# Altium schematic sheet Fonte_Chaveada_ISL6236.SchDoc
size A3
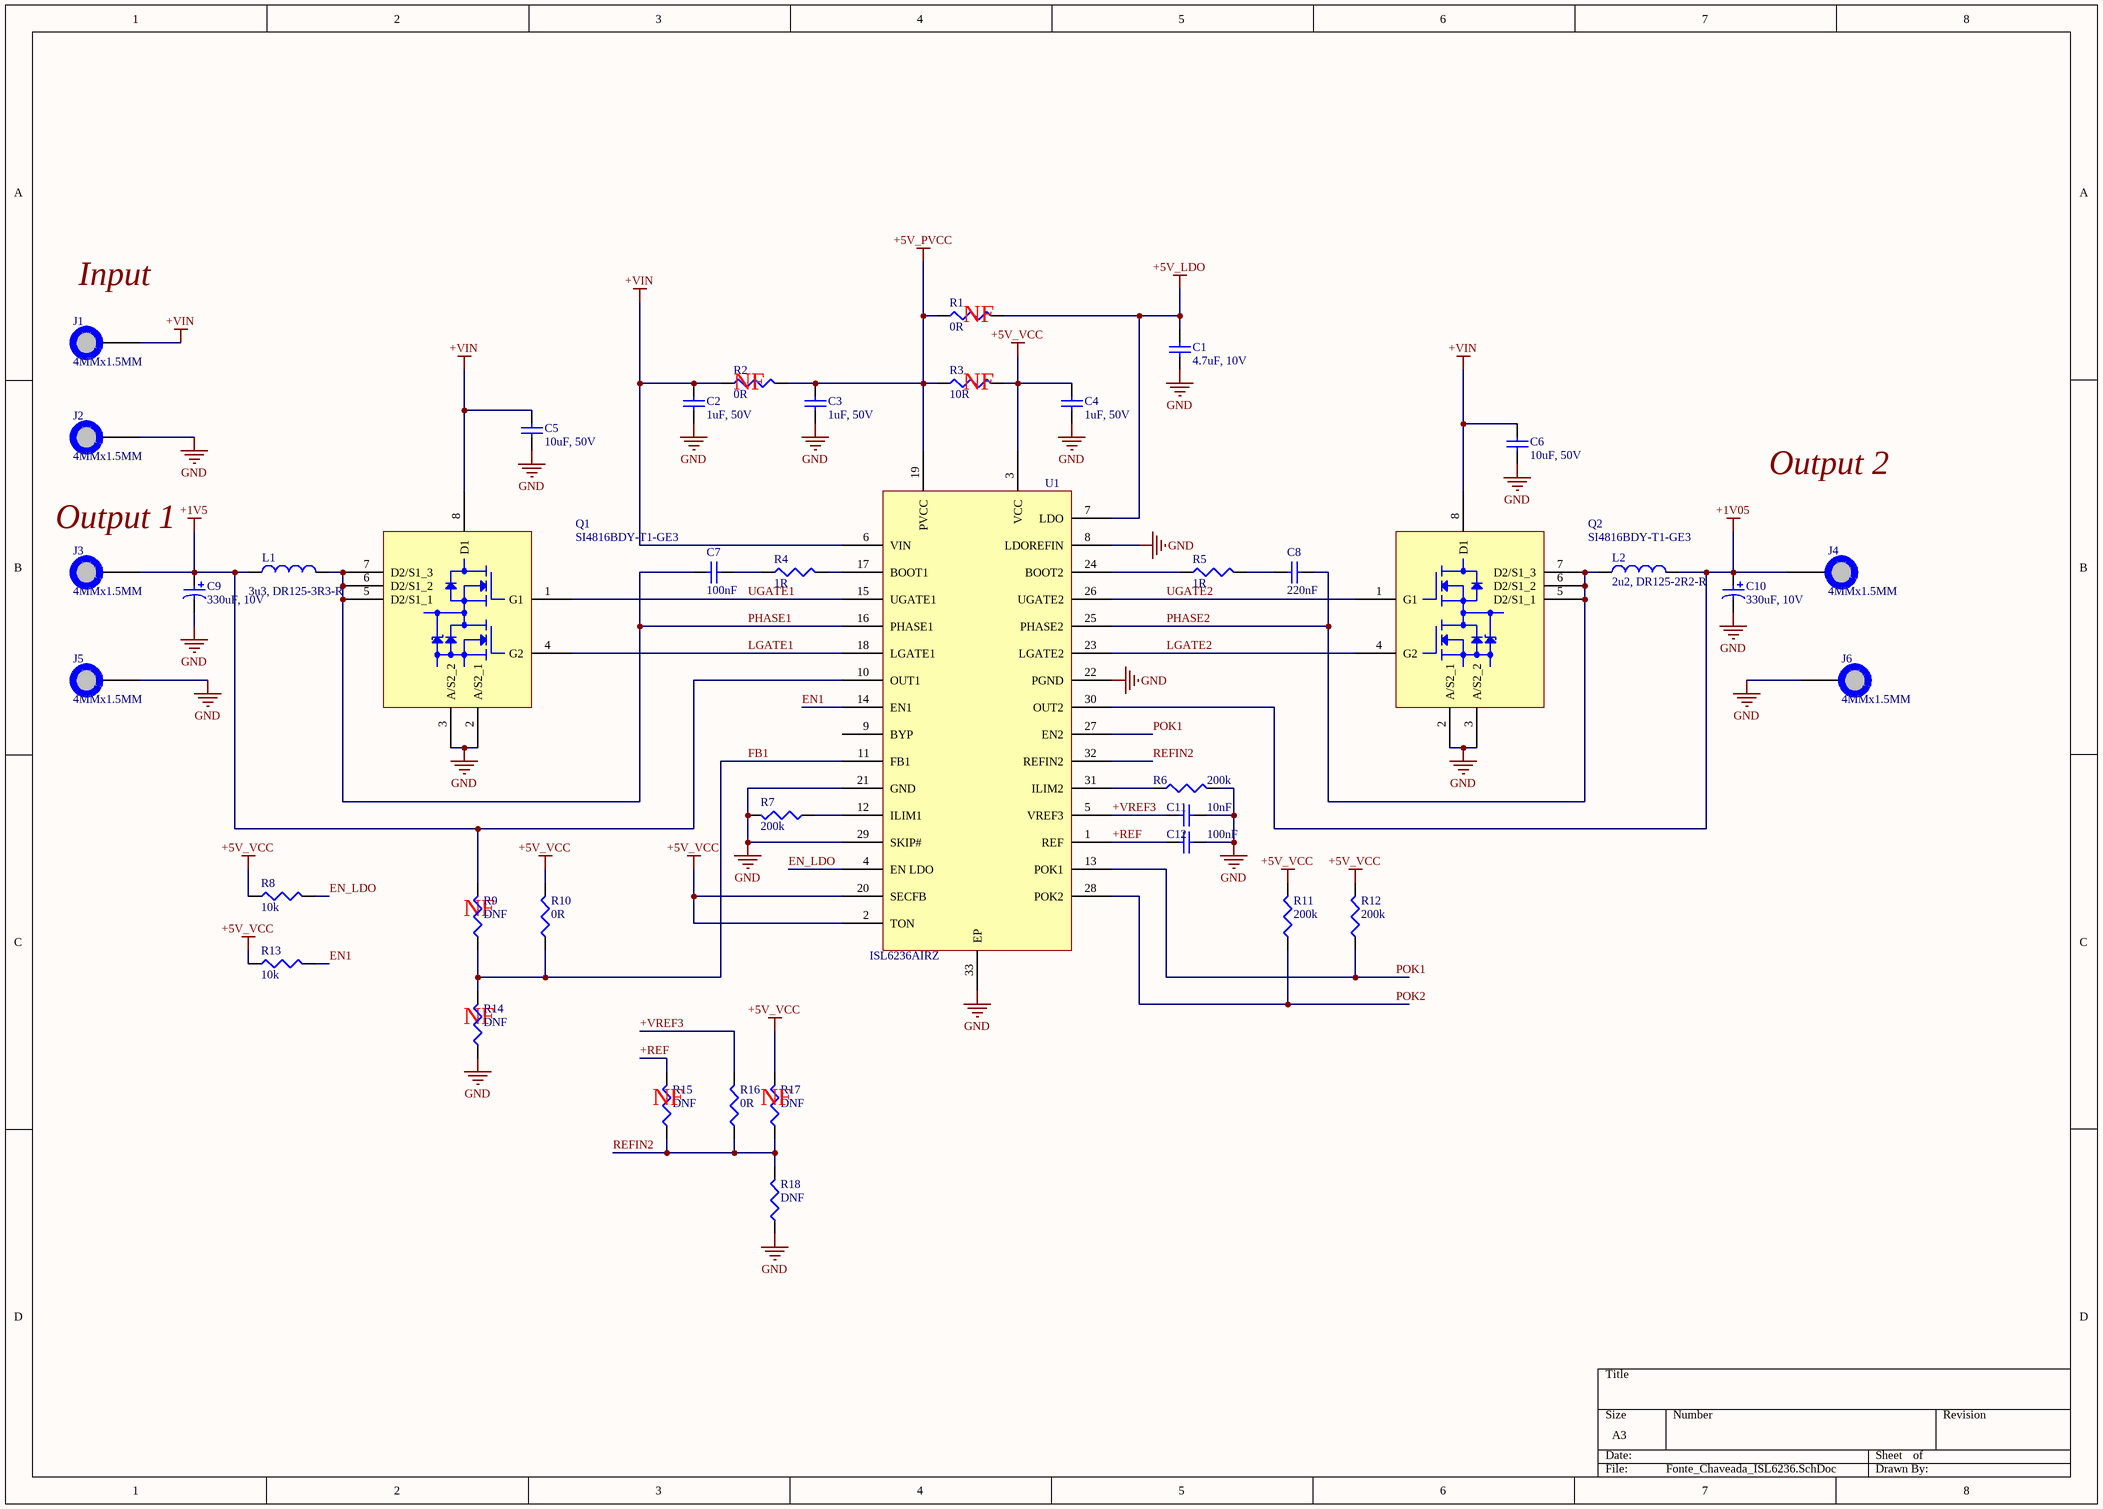
[diagram p0: Fonte_Chaveada_ISL6236.SchDoc]

## Parts
C1  4.7uF, 10V  [C1206]
C2  1uF, 50V  [C0805]
C3  1uF, 50V  [C0805]
C4  1uF, 50V  [C0805]
C5  10uF, 50V  [C1210]
C6  10uF, 50V  [C1210]
C7  100nF  [C0805]
C8  220nF  [C0805]
C9  330uF, 10V  [7343-43]
C10  330uF, 10V  [7343-43]
C11  10nF  [C0805]
C12  100nF  [C0805]
J1  4MMx1.5MM  [PAD]
J2  4MMx1.5MM  [PAD]
J3  4MMx1.5MM  [PAD]
J4  4MMx1.5MM  [PAD]
J5  4MMx1.5MM  [PAD]
J6  4MMx1.5MM  [PAD]
L1  3u3, DR125-3R3-R  [DR125]
L2  2u2, DR125-2R2-R  [DR125]
Q1  SI4816BDY-T1-GE3  [SO-8]
Q2  SI4816BDY-T1-GE3  [SO-8]
R1  0R  [R0805]
R2  0R  [R0805]
R3  10R  [R0805]
R4  1R  [R0805]
R5  1R  [R0805]
R6  200k  [R0805]
R7  200k  [R0805]
R8  10k  [R0805]
R9  DNF  [R0805]
R10  0R  [R0805]
R11  200k  [R0805]
R12  200k  [R0805]
R13  10k  [R0805]
R14  DNF  [R0805]
R15  DNF  [R0805]
R16  0R  [R0805]
R17  DNF  [R0805]
R18  DNF  [R0805]
U1  ISL6236AIRZ  [L32.5x5B]

## Nets
+1V5: C9.1 J3.1 L1.1 R9.2 U1.10(OUT1)
+1V05: C10.1 J4.1 L2.2 U1.30(OUT2)
+5V_LDO: C1.2 R1.2 U1.7(LDO)
+5V_PVCC: C3.2 R1.1 R2.2 R3.1 U1.19(PVCC)
+5V_VCC: C4.2 R3.2 R8.1 R10.2 R11.2 R12.2 R13.1 R17.2 U1.2(TON) U1.3(VCC) U1.20(SECFB)
+VIN: C2.2 C5.2 C6.2 J1.1 Q1.8(D1) Q2.8(D1) R2.1 U1.6(VIN)
GND: C1.1 C2.1 C3.1 C4.1 C5.1 C6.1 C9.2 C10.2 C11.2 C12.2 J2.1 J5.1 J6.1 Q1.2(A/S2_1) Q1.3(A/S2_2) Q2.2(A/S2_1) Q2.3(A/S2_2) R6.2 R7.2 R14.1 R18.1 U1.8(LDOREFIN) U1.21(GND) U1.22(PGND) U1.29(SKIP#) U1.33(EP)
+REF: C12.1 R15.2 U1.1(REF)
+VREF3: C11.1 R16.2 U1.5(VREF3)
EN1: R13.2 U1.14(EN1)
EN_LDO: R8.2 U1.4(EN_LDO)
FB1: R9.1 R10.1 R14.2 U1.11(FB1)
LGATE1: Q1.4(G2) U1.18(LGATE1)
LGATE2: Q2.4(G2) U1.23(LGATE2)
PHASE1: C7.1 L1.2 Q1.5(D2/S1_1) Q1.6(D2/S1_2) Q1.7(D2/S1_3) U1.16(PHASE1)
PHASE2: C8.2 L2.1 Q2.5(D2/S1_1) Q2.6(D2/S1_2) Q2.7(D2/S1_3) U1.25(PHASE2)
POK1: R12.1 U1.13(POK1) U1.27(EN2)
POK2: R11.1 U1.28(POK2)
REFIN2: R15.1 R16.1 R17.1 R18.2 U1.32(REFIN2)
UGATE1: Q1.1(G1) U1.15(UGATE1)
UGATE2: Q2.1(G1) U1.26(UGATE2)
NetC7_2: C7.2 R4.1
NetC8_1: C8.1 R5.2
NetR4_2: R4.2 U1.17(BOOT1)
NetR5_1: R5.1 U1.24(BOOT2)
NetR6_1: R6.1 U1.31(ILIM2)
NetR7_1: R7.1 U1.12(ILIM1)

Not connected (* = marked no-connect by the designer): U1 9(BYP)

## Notes on the sheet
- (near J1) Input
- (near R1) NF
- (near R2) NF
- (near R3) NF
- Output 2
- Output 1
- (near R9) NF
- (near R14) NF
- (near R15) NF
- (near R17) NF

## Library data of the parts
C1 = C3216X5R1A475K: 4.7µF ±10% 10V X5R Ceramic Capacitor -55°C ~ 85°C Surface Mount, MLCC 1206 (3216 Metric) 0.126" L x 0.063" W (3.20mm x 1.60mm); Manufacturer: TDK; Supplier 1: Digi-Key; Manufacturer Part Number: C3216X5R1A475K; Stock 1: 0; Mount: Surface Mount; Case/Package: 1206; Number of Pins: 2; Case Code (Metric): 3216; Case Code (Imperial): 1206; Dielectric Material: Ceramic; Min Operating Temperature: -55°C; Max Operating Temperature: 85°C; Capacitance: 4.7uF; Tolerance: 10%; Package Quantity: 2000; Voltage Rating: 10V; Packaging: Tape and Reel; Dielectric: X5R; Termination: SMD/SMT; Voltage Rating (DC): 10V; Length: 3.2mm; Width: 0.063inch; Thickness: 0.071inch; Depth: 1.6mm; Radiation Hardening: No; Lead Free: Lead Free; ComponentLink1URL: https://media.digikey.com/pdf/Data%20Sheets/TDK%20PDFs/C_Series_GeneralAppl_Spec_rev_0.3_201012.pdf; ComponentLink1Description: https://media.digikey.com/pdf/Data%20Sheets/TDK%20PDFs/C_Series_GeneralAppl_Spec_rev_0.3_201012.pdf; ComponentLink2URL: https://www.verical.com/server-webapp/html/getDatasheet?partID=178730; ComponentLink2Description: https://www.verical.com/server-webapp/html/getDatasheet?partID=178730; ComponentLink3URL: http://www.tdk.co.jp/tefe02/e412_c.pdf; ComponentLink3Description: http://www.tdk.co.jp/tefe02/e412_c.pdf; ComponentLink4URL: http://www.mouser.com/ds/2/400/tdk_mlcc_commercial_general_en-542463.pdf; ComponentLink4Description: http://www.mouser.com/ds/2/400/tdk_mlcc_commercial_general_en-542463.pdf; ComponentLink5URL: http://www.farnell.com/datasheets/1571323.pdf; ComponentLink5Description: http://www.farnell.com/datasheets/1571323.pdf; ComponentLink6URL: http://www.onlinecomponents.com/productFiles/mf-TDK/e412_c.pdf; ComponentLink6Description: http://www.onlinecomponents.com/productFiles/mf-TDK/e412_c.pdf; Supplier Part Number 1: 445-1386-6-ND
C2-C4 = C2012X7R1H105K125AB: CAP CER 1UF 50V X7R 0805; Manufacturer: TDK; Dielectric Material: Ceramic; Tolerance: 10%; Supplier 1: Digi-Key; Manufacturer Part Number: C2012X7R1H105K125AB; Stock 1: 20000; Pricing 1: 1=0.42, 10=0.286, 100=0.1619, 500=0.1143, 1000=0.1 (USD); Mount: Surface Mount; Case/Package: 0805; Number of Pins: 2; Weight: 0.000194oz; Case Code (Metric): 2012; Case Code (Imperial): 0805; Min Operating Temperature: -55°C; Max Operating Temperature: 125°C; Packaging: Tape and Reel; Package Quantity: 1; Capacitance: 1uF; Voltage Rating: 50V; Voltage Rating (DC): 50V; Dielectric: X7R; Termination: SMD/SMT; Composition: Ceramic; Length: 2mm; Height: 1.25mm; Width: 0.049inch; Thickness: 0.057inch; Depth: 1.25mm; Radiation Hardening: No; REACH SVHC: No SVHC; Lead Free: Lead Free; ComponentLink1URL: http://www.farnell.com/datasheets/1796654.pdf; ComponentLink1Description: http://www.farnell.com/datasheets/1796654.pdf; ComponentLink2URL: https://product.tdk.com/info/en/catalog/spec/mlccspec_commercial_general_midvoltage_en.pdf; ComponentLink2Description: https://product.tdk.com/info/en/catalog/spec/mlccspec_commercial_general_midvoltage_en.pdf; ComponentLink3URL: http://www.tdk.com/pdf/general_B11.pdf; ComponentLink3Description: http://www.tdk.com/pdf/general_B11.pdf; ComponentLink4URL: http://www.mouser.com/ds/2/400/lcc_commercial_general_en-837201.pdf; ComponentLink4Description: http://www.mouser.com/ds/2/400/lcc_commercial_general_en-837201.pdf; ComponentLink5URL: http://www.farnell.com/datasheets/2291921.pdf; ComponentLink5Description: http://www.farnell.com/datasheets/2291921.pdf; ComponentLink6URL: http://product.tdk.com/capacitor/mlcc/en/documents/mlcc_commercial_general_en.pdf; ComponentLink6Description: http://product.tdk.com/capacitor/mlcc/en/documents/mlcc_commercial_general_en.pdf; Supplier Part Number 1: 445-7547-6-ND
C5 C6 = UMK325BJ106MM-T: CAP CER 10UF 50V X5R 1210; Manufacturer: Taiyo Yuden; Tolerance: 20%; Supplier 1: Digi-Key; Manufacturer Part Number: UMK325BJ106MM-T; Stock 1: 0; Pricing 1: 1=0.78, 10=0.554, 100=0.3645 (USD); Mount: Surface Mount; Case/Package: 1210; Number of Pins: 2; Case Code (Metric): 3225; Case Code (Imperial): 1210; Contact Plating: Nickel; Min Operating Temperature: -55°C; Max Operating Temperature: 85°C; Capacitance: 10uF; Package Quantity: 500; Voltage Rating: 50V; Packaging: Tape and Reel; Voltage Rating (DC): 50V; Dielectric: X5R; Termination: SMD/SMT; Voltage: 50V; Length: 3.2mm; Height: 2.5mm; Width: 0.098inch; Thickness: 0.106inch; Depth: 2.5mm; Radiation Hardening: No; REACH SVHC: Unknown; Lead Free: Lead Free; Halogen Free: Halogen Free; ComponentLink1URL: https://www.yuden.co.jp/productdata/catalog/mlcc01_e.pdf; ComponentLink1Description: https://www.yuden.co.jp/productdata/catalog/mlcc01_e.pdf; ComponentLink2URL: http://www.farnell.com/datasheets/1497285.pdf; ComponentLink2Description: http://www.farnell.com/datasheets/1497285.pdf; ComponentLink3URL: http://www.onlinecomponents.com/productFiles/mf-TAI/1153umk325bj106mm-t.pdf; ComponentLink3Description: http://www.onlinecomponents.com/productFiles/mf-TAI/1153umk325bj106mm-t.pdf; ComponentLink4URL: http://www.yuden.co.jp/ut/product/pdf_html/pdf/mlcc_all_e.pdf; ComponentLink4Description: http://www.yuden.co.jp/ut/product/pdf_html/pdf/mlcc_all_e.pdf; ComponentLink5URL: http://www.yuden.co.jp/ut/product/category/capacitor/UMK325BJ106MM-T.pdf; ComponentLink5Description: http://www.yuden.co.jp/ut/product/category/capacitor/UMK325BJ106MM-T.pdf; ComponentLink6URL: http://www.farnell.com/datasheets/1481447.pdf; ComponentLink6Description: http://www.farnell.com/datasheets/1481447.pdf; Supplier Part Number 1: 587-2225-6-ND
C7 C12 = C2012X7R1H104K085AA: CAP CER 0.1UF 50V X7R 0805; Manufacturer: TDK; Dielectric Material: Ceramic; Tolerance: 10%; Supplier 1: Digi-Key; Manufacturer Part Number: C2012X7R1H104K085AA; Stock 1: 0; Pricing 1: 4000=0.0274 (USD); Mount: Surface Mount; Case/Package: 0805; Number of Pins: 2; Weight: 0.000194oz; Case Code (Metric): 2012; Case Code (Imperial): 0805; Min Operating Temperature: -55°C; Max Operating Temperature: 125°C; Package Quantity: 1; Packaging: Tape and Reel; Capacitance: 100nF; Voltage Rating: 50V; Voltage Rating (DC): 50V; Dielectric: X7R; Termination: SMD/SMT; Composition: Ceramic; Voltage: 50V; Length: 2mm; Height: 0.85mm; Width: 0.049inch; Thickness: 0.037inch; Depth: 1.25mm; Radiation Hardening: No; REACH SVHC: No SVHC; Lead Free: Lead Free; ComponentLink1URL: http://uk.rs-online.com/webdocs/1532/0900766b81532cd0.pdf; ComponentLink1Description: http://uk.rs-online.com/webdocs/1532/0900766b81532cd0.pdf; ComponentLink2URL: https://product.tdk.com/info/en/catalog/spec/mlccspec_commercial_general_midvoltage_en.pdf; ComponentLink2Description: https://product.tdk.com/info/en/catalog/spec/mlccspec_commercial_general_midvoltage_en.pdf; ComponentLink3URL: http://www.tdk.co.jp/tefe02/e412_c.pdf; ComponentLink3Description: http://www.tdk.co.jp/tefe02/e412_c.pdf; ComponentLink4URL: http://www.farnell.com/datasheets/1571323.pdf; ComponentLink4Description: http://www.farnell.com/datasheets/1571323.pdf; Supplier Part Number 1: 445-7534-2-ND
C8 = C2012X7R1H224K125AA: CAP CER 0.22UF 50V X7R 0805; Manufacturer: TDK; Dielectric Material: Ceramic; Tolerance: 10%; Supplier 1: Digi-Key; Manufacturer Part Number: C2012X7R1H224K125AA; Stock 1: 0; Pricing 1: 1=0.21, 10=0.152, 100=0.0713, 500=0.05, 1000=0.0414 (USD); Mount: Surface Mount; Case/Package: 0805; Number of Pins: 2; Weight: 0.000194oz; Case Code (Metric): 2012; Case Code (Imperial): 0805; Min Operating Temperature: -55°C; Max Operating Temperature: 125°C; Capacitance: 220nF; Voltage Rating: 50V; Packaging: Tape and Reel; Package Quantity: 1; Voltage Rating (DC): 50V; Dielectric: X7R; Termination: SMD/SMT; Composition: Ceramic; Voltage: 50V; Length: 2mm; Height: 1.25mm; Width: 0.049inch; Thickness: 0.057inch; Depth: 1.25mm; Radiation Hardening: No; REACH SVHC: No SVHC; Lead Free: Lead Free; ComponentLink1URL: http://www.tdk.co.jp/tefe02/e412_c.pdf; ComponentLink1Description: http://www.tdk.co.jp/tefe02/e412_c.pdf; ComponentLink2URL: https://product.tdk.com/info/en/catalog/spec/mlccspec_commercial_general_midvoltage_en.pdf; ComponentLink2Description: https://product.tdk.com/info/en/catalog/spec/mlccspec_commercial_general_midvoltage_en.pdf; ComponentLink3URL: http://www.farnell.com/datasheets/1571323.pdf; ComponentLink3Description: http://www.farnell.com/datasheets/1571323.pdf; ComponentLink4URL: http://uk.rs-online.com/webdocs/1532/0900766b81532cd0.pdf; ComponentLink4Description: http://uk.rs-online.com/webdocs/1532/0900766b81532cd0.pdf; ComponentLink5URL: http://www.mouser.com/ds/2/400/lcc_commercial_general_en-837201.pdf; ComponentLink5Description: http://www.mouser.com/ds/2/400/lcc_commercial_general_en-837201.pdf; Supplier Part Number 1: 445-1350-6-ND
C9 C10 = T530X337M010ATE004: Tantalum Capacitors - Polymer SMD 330uF 10volts 20%; Manufacturer: KEMET; Ripple Current: 8.2A; ESR (Equivalent Series Resistance): 4mR; Leakage Current: 330uA; Polarity: Polar; Dissipation Factor: 8%; Life (Hours): 2000Hour; Supplier 1: Digi-Key; Manufacturer Part Number: T530X337M010ATE004; Stock 1: 0; Pricing 1: 1=6.86, 10=6.095, 100=4.876 (USD); Mount: PCB,Surface Mount; Case/Package: 2917; Case Code (Imperial): 2917; Case Code (Metric): 7343; Min Operating Temperature: -55°C; Max Operating Temperature: 125°C; Package Quantity: 500; Voltage Rating (DC): 10V; Capacitance: 330uF; Tolerance: 20%; Packaging: Tape and Reel; Voltage Rating: 10V; Termination: SMD/SMT; Voltage: 10V; Features: General Purpose; Length: 7.3mm; Height: 4mm; Width: 4.3mm; Height - Seated (Max): 0.169inch; Depth: 4.3mm; REACH SVHC: No SVHC; ComponentLink1URL: https://www.alliedelec.com/m/d/c2b5846d1b4015924ec44504ba06510b.pdf; ComponentLink1Description: https://www.alliedelec.com/m/d/c2b5846d1b4015924ec44504ba06510b.pdf; ComponentLink2URL: http://uk.rs-online.com/webdocs/1529/0900766b815291cb.pdf; ComponentLink2Description: http://uk.rs-online.com/webdocs/1529/0900766b815291cb.pdf; Supplier Part Number 1: 399-10378-6-ND
C11 = VJ0805Y103KNAAO: CAP CER 10000PF 50V X7R 0805; Manufacturer: Vishay Vitramon; Tolerance: 10%; Supplier 1: Digi-Key; Manufacturer Part Number: VJ0805Y103KNAAO; Stock 1: 211; Pricing 1: 1=0.88, 10=0.65, 100=0.4457 (USD); Mount: Surface Mount; Case/Package: 0805; Case Code (Metric): 2012; Case Code (Imperial): 0805; Min Operating Temperature: -55°C; Max Operating Temperature: 125°C; Packaging: Tape and Reel; Capacitance: 10nF; Package Quantity: 1; Voltage Rating: 50V; Voltage Rating (DC): 50V; Dielectric: X7R; Termination: SMD/SMT; Voltage: 50V; Length: 2mm; Height: 1.45mm; Width: 0.049inch; Thickness: 0.057inch; Depth: 1.25mm; Radiation Hardening: No; REACH SVHC: Unknown; ComponentLink1URL: http://www.vishay.com/docs/45128/nonmagneticepoxybond.pdf; ComponentLink1Description: http://www.vishay.com/docs/45128/nonmagneticepoxybond.pdf; ComponentLink2URL: http://www.farnell.com/datasheets/1805046.pdf; ComponentLink2Description: http://www.farnell.com/datasheets/1805046.pdf; Supplier Part Number 1: 720-1244-1-ND
J1-J6 = PAD com furo
L1 = DR125-3R3-R: COILTRONICS   DR125-3R3-R   Surface Mount Power Inductor, DR Series, 3.3 H,  20%, Shielded, 9.26 A; Manufacturer: Eaton Coiltronics; Core Material: Ferrite; Inductance: 3.3uh; Max DC Current: 12.7A; DC Resistance (DCR): 6.3mR; Test Frequency: 100kHz; RMS Current (Irms): 9.26A; Supplier 1: Digi-Key; Manufacturer Part Number: DR125-3R3-R; Stock 1: 4659; Pricing 1: 1=2.03, 10=1.873, 100=1.3113 (USD); Mount: Surface Mount; Case/Package: 0125; Number of Pins: 2; Weight: 0.144oz; Min Operating Temperature: -40°C; Max Operating Temperature: 125°C; Tolerance: 20%; Packaging: Tape and Reel; Shielding: Shielded; Inductance Tolerance: 20%; Package Quantity: 600; Termination: SMD/SMT; Military Standard: Not; Saturation Current: 12.7A; Self Resonant Frequency: 100kHz; Length: 12.5mm; Height: 6mm; Width: 12.5mm; Depth: 12.5mm; Radiation Hardening: No; REACH SVHC: No SVHC; Lead Free: Lead Free; ComponentLink1URL: http://www.farnell.com/datasheets/87246.pdf; ComponentLink1Description: http://www.farnell.com/datasheets/87246.pdf; Supplier Part Number 1: 513-1529-6-ND
L2 = DR125-2R2-R: Fixed Inductors 2.2uH 15A 0.0045ohms; Manufacturer: Eaton Cooper; Core Material: Ferrite; Current Rating: 10.9A; Tolerance: 20%; Shielding: Shielded; DC Resistance (DCR): 4.5mR; Test Frequency: 100kHz; Supplier 1: Digi-Key; Manufacturer Part Number: DR125-2R2-R; Stock 1: 175; Pricing 1: 1=2.03, 10=1.873, 100=1.3113 (USD); Mount: Surface Mount; Case/Package: Nonstandard; Number of Pins: 2; Weight: 0.144oz; Min Operating Temperature: -40°C; Max Operating Temperature: 125°C; Package Quantity: 600; Saturation Current: 15A; Packaging: Tape and Reel; Inductance: 2.2uh; Inductance Tolerance: 20%; Composition: Wirewound; Max DC Current: 10.9A; Termination: SMD/SMT; Self Resonant Frequency: 100kHz; DC Current: 10.9A; Military Standard: Not; RMS Current (Irms): 10.9A; Length: 12.5mm; Height: 6mm; Width: 0.492inch; Height - Seated (Max): 0.236inch; Depth: 12.5mm; Radiation Hardening: No; REACH SVHC: No SVHC; Lead Free: Lead Free; ComponentLink1URL: https://www.verical.com/server-webapp/html/getDatasheet?partID=571249; ComponentLink1Description: https://www.verical.com/server-webapp/html/getDatasheet?partID=571249; ComponentLink2URL: http://uk.rs-online.com/webdocs/116a/0900766b8116a153.pdf; ComponentLink2Description: http://uk.rs-online.com/webdocs/116a/0900766b8116a153.pdf; ComponentLink3URL: http://www.farnell.com/datasheets/87246.pdf; ComponentLink3Description: http://www.farnell.com/datasheets/87246.pdf; Supplier Part Number 1: 513-1662-6-ND
Q1 Q2 = SI4816BDY-T1-GE3: MOSFET 2N-CH 30V 5.8A 8-SOIC; Manufacturer: Vishay Siliconix; Rise Time: 9ns; Rds On Max: 18.5mR; Gate to Source Voltage (Vgs): 20V; Drain to Source Resistance: 9.3mR; Max Power Dissipation: 1.25W; Turn-Off Delay Time: 31ns; Turn-On Delay Time: 13ns; Number of Elements: 2; Threshold Voltage: 3V; FET Type: 2 N-Channel; Supplier 1: Digi-Key; Manufacturer Part Number: SI4816BDY-T1-GE3; Stock 1: 0; Pricing 1: 1=1.86, 10=1.681, 100=1.3511, 500=1.0509, 1000=0.8707 (USD); Mount: Surface Mount; Case/Package: SO; Number of Pins: 8; Weight: 0.006596oz; Contact Plating: Matte,Tin; Min Operating Temperature: -55°C; Max Operating Temperature: 150°C; Packaging: Tape and Reel; Package Quantity: 1; Drain to Source Voltage (Vdss): 30V; Continuous Drain Current (ID): 5.8A; Fall Time: 9ns; Number of Channels: 2; On-State Resistance: 18.5mR; Length: 5mm; Height: 1.55mm; Width: 4mm; Radiation Hardening: No; REACH SVHC: No SVHC; Lead Free: Lead Free; ComponentLink1URL: http://www.farnell.com/datasheets/1911984.pdf; ComponentLink1Description: http://www.farnell.com/datasheets/1911984.pdf; ComponentLink2URL: http://www.farnell.com/datasheets/2049212.pdf; ComponentLink2Description: http://www.farnell.com/datasheets/2049212.pdf; ComponentLink3URL: http://www.vishay.com/docs/73026/si4816bd.pdf; ComponentLink3Description: http://www.vishay.com/docs/73026/si4816bd.pdf; ComponentLink4URL: http://datasheet.iiic.cc/vishay_[siliconix]/SI4816BDY-T1-GE3.pdf; ComponentLink4Description: http://datasheet.iiic.cc/vishay_[siliconix]/SI4816BDY-T1-GE3.pdf; Supplier Part Number 1: SI4816BDY-T1-GE3DKR-ND
R1 R2 R10 R16 = ERJ6GEY0R00V: Res Thick Film 0805 0 Ohm Molded SMD SMD Embossed Carrier T/R; Manufacturer: Panasonic; Voltage Rating: 150V; Resistance: 0mR; Power Rating: 125mW; Tolerance: 5%; Temperature Coefficient: 600ppm/°C; Current Rating: 2A; Supplier 1: Digi-Key; Manufacturer Part Number: ERJ6GEY0R00V; Stock 1: 6984745; Pricing 1: 1=0.1, 10=0.06, 25=0.0432, 50=0.033, 100=0.0243, 250=0.0185, 500=0.0148, 1000=0.0109 (USD); Mount: Surface Mount; Case/Package: 0805; Case Code (Imperial): 0805; Case Code (Metric): 2012; Contact Plating: Tin; Min Operating Temperature: -55°C; Max Operating Temperature: 155°C; Packaging: Tape and Reel; Package Quantity: 1; Termination: SMD/SMT; Composition: Thick Film; Number of Terminations: 2; Military Standard: Not; Max Power Dissipation: 125mW; Voltage Rating (DC): 150V; Features: Automotive AEC-Q200; Length: 2mm; Height: 0.6mm; Width: 1.25mm; Depth: 1.25mm; Radiation Hardening: No; REACH SVHC: No SVHC; Lead Free: Lead Free; ComponentLink1URL: http://www.farnell.com/datasheets/1678796.pdf; ComponentLink1Description: http://www.farnell.com/datasheets/1678796.pdf; ComponentLink2URL: http://www.farnell.com/datasheets/2371628.pdf; ComponentLink2Description: http://www.farnell.com/datasheets/2371628.pdf; ComponentLink3URL: http://industrial.panasonic.com/www-data/pdf/AOA0000/AOA0000CE1.pdf; ComponentLink3Description: http://industrial.panasonic.com/www-data/pdf/AOA0000/AOA0000CE1.pdf; ComponentLink4URL: http://industrial.panasonic.com/www-cgi/jvcr13pz.cgi?E+PZ+3+AOA0001+ERJ6GEY0R00V+7+WW; ComponentLink4Description: http://industrial.panasonic.com/www-cgi/jvcr13pz.cgi?E+PZ+3+AOA0001+ERJ6GEY0R00V+7+WW; Supplier Part Number 1: P0.0ACT-ND
R3 = ERJ6GEYJ100V: Res Thick Film 0805 10 Ohm 5% 0.125W(1/8W) ±200ppm/C Molded SMD Automotive Punched T/R; Manufacturer: Panasonic; Voltage Rating (DC): 150V; Power Rating: 125mW; Temperature Coefficient: 200ppm/°C; Supplier 1: Digi-Key; Manufacturer Part Number: ERJ6GEYJ100V; Stock 1: 631964; Pricing 1: 1=0.1, 10=0.061, 100=0.0249, 1000=0.0112, 2500=0.0097 (USD); Mount: Surface Mount; Case/Package: 0805; Case Code (Metric): 2012; Case Code (Imperial): 0805; Contact Plating: Tin; Min Operating Temperature: -55°C; Max Operating Temperature: 155°C; Packaging: Tape and Reel; Package Quantity: 5000; Resistance: 10R; Tolerance: 5%; Voltage Rating: 150V; Composition: Thick Film; Number of Terminations: 2; Termination: SMD/SMT; Military Standard: Not; Max Power Dissipation: 125mW; Working Voltage: 150V; Length: 2mm; Height: 0.6mm; Width: 0.049inch; Depth: 1.25mm; Radiation Hardening: No; Lead Free: Lead Free; REACH SVHC: No SVHC; ComponentLink1URL: https://www.verical.com/server-webapp/html/getDatasheet?partID=247141; ComponentLink1Description: https://www.verical.com/server-webapp/html/getDatasheet?partID=247141; ComponentLink2URL: http://industrial.panasonic.com/www-data/pdf/AOA0000/AOA0000CE1.pdf; ComponentLink2Description: http://industrial.panasonic.com/www-data/pdf/AOA0000/AOA0000CE1.pdf; ComponentLink3URL: https://www.alliedelec.com/m/d/51cd0790071e1666bdb9d00c57fcf960.pdf; ComponentLink3Description: https://www.alliedelec.com/m/d/51cd0790071e1666bdb9d00c57fcf960.pdf; ComponentLink4URL: http://www.farnell.com/datasheets/1500035.pdf; ComponentLink4Description: http://www.farnell.com/datasheets/1500035.pdf; ComponentLink5URL: http://www.jameco.com/Jameco/Products/ProdDS/1989615.pdf; ComponentLink5Description: http://www.jameco.com/Jameco/Products/ProdDS/1989615.pdf; ComponentLink6URL: http://www.farnell.com/datasheets/2371628.pdf; ComponentLink6Description: http://www.farnell.com/datasheets/2371628.pdf; Supplier Part Number 1: P10ADKR-ND
R4 R5 = ERJ6RQF1R0V: Res Thick Film 0805 1 Ohm 1% 0.125W(1/8W) ±200ppm/C Molded SMD Automotive Punched T/R; Manufacturer: Panasonic; Power Rating: 125mW; Temperature Coefficient: 200ppm/°C; Supplier 1: Digi-Key; Manufacturer Part Number: ERJ6RQF1R0V; Stock 1: 71693; Pricing 1: 1=0.37, 10=0.311, 25=0.2264, 50=0.1642, 100=0.1217, 250=0.0934, 500=0.0736, 1000=0.0509 (USD); Mount: Surface Mount; Case/Package: 0805; Number of Pins: 2; Case Code (Imperial): 0805; Case Code (Metric): 2012; Contact Plating: Tin; Min Operating Temperature: -55°C; Max Operating Temperature: 125°C; Packaging: Tape and Reel; Package Quantity: 5000; Resistance: 1R; Tolerance: 1%; Termination: SMD/SMT; Composition: Thick Film; Number of Terminations: 2; Military Standard: Not; Max Power Dissipation: 125mW; Length: 2mm; Height: 0.6mm; Width: 1.2mm; Depth: 1.25mm; Radiation Hardening: No; Lead Free: Lead Free; REACH SVHC: No SVHC; ComponentLink1URL: http://uk.rs-online.com/webdocs/13b8/0900766b813b869e.pdf; ComponentLink1Description: http://uk.rs-online.com/webdocs/13b8/0900766b813b869e.pdf; ComponentLink2URL: http://www.farnell.com/datasheets/391509.pdf; ComponentLink2Description: http://www.farnell.com/datasheets/391509.pdf; ComponentLink3URL: https://www.alliedelec.com/m/d/343577d27580f3e2a275b8e77c10f6b8.pdf; ComponentLink3Description: https://www.alliedelec.com/m/d/343577d27580f3e2a275b8e77c10f6b8.pdf; ComponentLink4URL: http://industrial.panasonic.com/www-data/pdf/AOA0000/AOA0000CE3.pdf; ComponentLink4Description: http://industrial.panasonic.com/www-data/pdf/AOA0000/AOA0000CE3.pdf; ComponentLink5URL: http://www.jameco.com/Jameco/Products/ProdDS/1381829.pdf; ComponentLink5Description: http://www.jameco.com/Jameco/Products/ProdDS/1381829.pdf; Supplier Part Number 1: P1.0DDKR-ND
R6 R7 R11 R12 = ERJ6ENF2003V: Res Thick Film 0805 200K Ohm 1% 1/8W ±100ppm/C Molded SMD Punched Carrier T/R; Manufacturer: Panasonic; Power Rating: 125mW; Voltage Rating: 150V; Resistance: 200kR; Temperature Coefficient: 100ppm/°C; Supplier 1: Digi-Key; Manufacturer Part Number: ERJ6ENF2003V; Stock 1: 488340; Pricing 1: 1=0.1, 10=0.081, 100=0.0311, 1000=0.0137, 2500=0.0118 (USD); Mount: Surface Mount; Case/Package: 0805; Case Code (Imperial): 0805; Case Code (Metric): 2012; Contact Plating: Tin; Min Operating Temperature: -55°C; Max Operating Temperature: 155°C; Tolerance: 1%; Packaging: Tape and Reel; Package Quantity: 1; Termination: SMD/SMT; Composition: Thick Film; Number of Terminations: 2; Military Standard: Not; Max Power Dissipation: 125mW; Voltage Rating (DC): 150V; Features: Automotive AEC-Q200; Length: 2mm; Height: 0.6mm; Width: 1.2mm; Depth: 1.25mm; Radiation Hardening: No; REACH SVHC: No SVHC; Lead Free: Lead Free; ComponentLink1URL: http://components.arrow.com/part/dataview/3986166S2126568N1386; ComponentLink1Description: http://components.arrow.com/part/dataview/3986166S2126568N1386; ComponentLink2URL: http://www.mouser.com/ds/2/315/AOA0000CE2-37512.pdf; ComponentLink2Description: http://www.mouser.com/ds/2/315/AOA0000CE2-37512.pdf; ComponentLink3URL: http://www.farnell.com/datasheets/1911175.pdf; ComponentLink3Description: http://www.farnell.com/datasheets/1911175.pdf; ComponentLink4URL: http://www.farnell.com/datasheets/1678782.pdf; ComponentLink4Description: http://www.farnell.com/datasheets/1678782.pdf; ComponentLink5URL: http://industrial.panasonic.com/www-data/pdf/AOA0000/AOA0000CE2.pdf; ComponentLink5Description: http://industrial.panasonic.com/www-data/pdf/AOA0000/AOA0000CE2.pdf; Supplier Part Number 1: P200KCDKR-ND
R8 R13 = ERJ6GEYJ103V: Res Thick Film 0805 10K Ohm 5% 0.125W(1/8W) ±200ppm/C Molded SMD Automotive Punched T/R; Manufacturer: Panasonic; Resistance: 10kR; Power Rating: 125mW; Voltage Rating: 150V; Temperature Coefficient: 200ppm/°C; Supplier 1: Digi-Key; Manufacturer Part Number: ERJ6GEYJ103V; Stock 1: 6308764; Pricing 1: 1=0.1, 10=0.061, 100=0.0249, 1000=0.0112, 2500=0.0097 (USD); Mount: Surface Mount; Case/Package: 0805; Case Code (Metric): 2012; Case Code (Imperial): 0805; Contact Plating: Tin; Min Operating Temperature: -55°C; Max Operating Temperature: 155°C; Tolerance: 5%; Packaging: Tape and Reel; Package Quantity: 5000; Composition: Thick Film; Number of Terminations: 2; Termination: SMD/SMT; Military Standard: Not; Max Power Dissipation: 125mW; Voltage Rating (DC): 150V; Features: Automotive AEC-Q200; Length: 2mm; Height: 0.6mm; Width: 0.049inch; Depth: 1.25mm; Radiation Hardening: No; REACH SVHC: No SVHC; Lead Free: Lead Free; ComponentLink1URL: http://www.farnell.com/datasheets/1500035.pdf; ComponentLink1Description: http://www.farnell.com/datasheets/1500035.pdf; ComponentLink2URL: http://www.farnell.com/datasheets/2059623.pdf; ComponentLink2Description: http://www.farnell.com/datasheets/2059623.pdf; ComponentLink3URL: http://www.alliedelec.com/m/d/51cd0790071e1666bdb9d00c57fcf960.pdf; ComponentLink3Description: http://www.alliedelec.com/m/d/51cd0790071e1666bdb9d00c57fcf960.pdf; ComponentLink4URL: http://industrial.panasonic.com/www-data/pdf/AOA0000/AOA0000CE1.pdf; ComponentLink4Description: http://industrial.panasonic.com/www-data/pdf/AOA0000/AOA0000CE1.pdf; ComponentLink5URL: http://www.farnell.com/datasheets/1678796.pdf; ComponentLink5Description: http://www.farnell.com/datasheets/1678796.pdf; ComponentLink6URL: http://www.farnell.com/datasheets/2371628.pdf; ComponentLink6Description: http://www.farnell.com/datasheets/2371628.pdf; Supplier Part Number 1: P10KADKR-ND
R9 R14 R15 R17 R18 = RES
U1 = ISL6236AIRZ: IC MAIN PWR CTRLR QUAD 32-QFN; Manufacturer: Intersil; Number of Outputs: 2; Output Current: 20A; Switching Frequency: 500kHz; Supplier 1: Digi-Key; Manufacturer Part Number: ISL6236AIRZ; Stock 1: 0; Pricing 1: 600=5.4796 (AUD); Mount: Surface Mount; Case/Package: QFN; Min Operating Temperature: -40°C; Max Operating Temperature: 100°C; Packaging: Rail/Tube; Package Quantity: 60; Length: 5mm; Height: 0.95mm; Width: 5mm; Radiation Hardening: No; Lead Free: Lead Free; ComponentLink1URL: http://www.intersil.com/content/dam/Intersil/documents/isl6/isl6236a.pdf; ComponentLink1Description: http://www.intersil.com/content/dam/Intersil/documents/isl6/isl6236a.pdf; Supplier Part Number 1: ISL6236AIRZ-ND